# Altium schematic sheet C-11 SOM HDR.SchDoc
size 513 x 386 mm; Address1: 350W 9th Ave; Address2: Suite 206; Address3: Escondido CA 92025; Address4: United States; Revision: -; ENG_APP_DATE: --/--/--; DSN_APP_DATE: --/--/--; CHK_APP_DATE: --/--/--
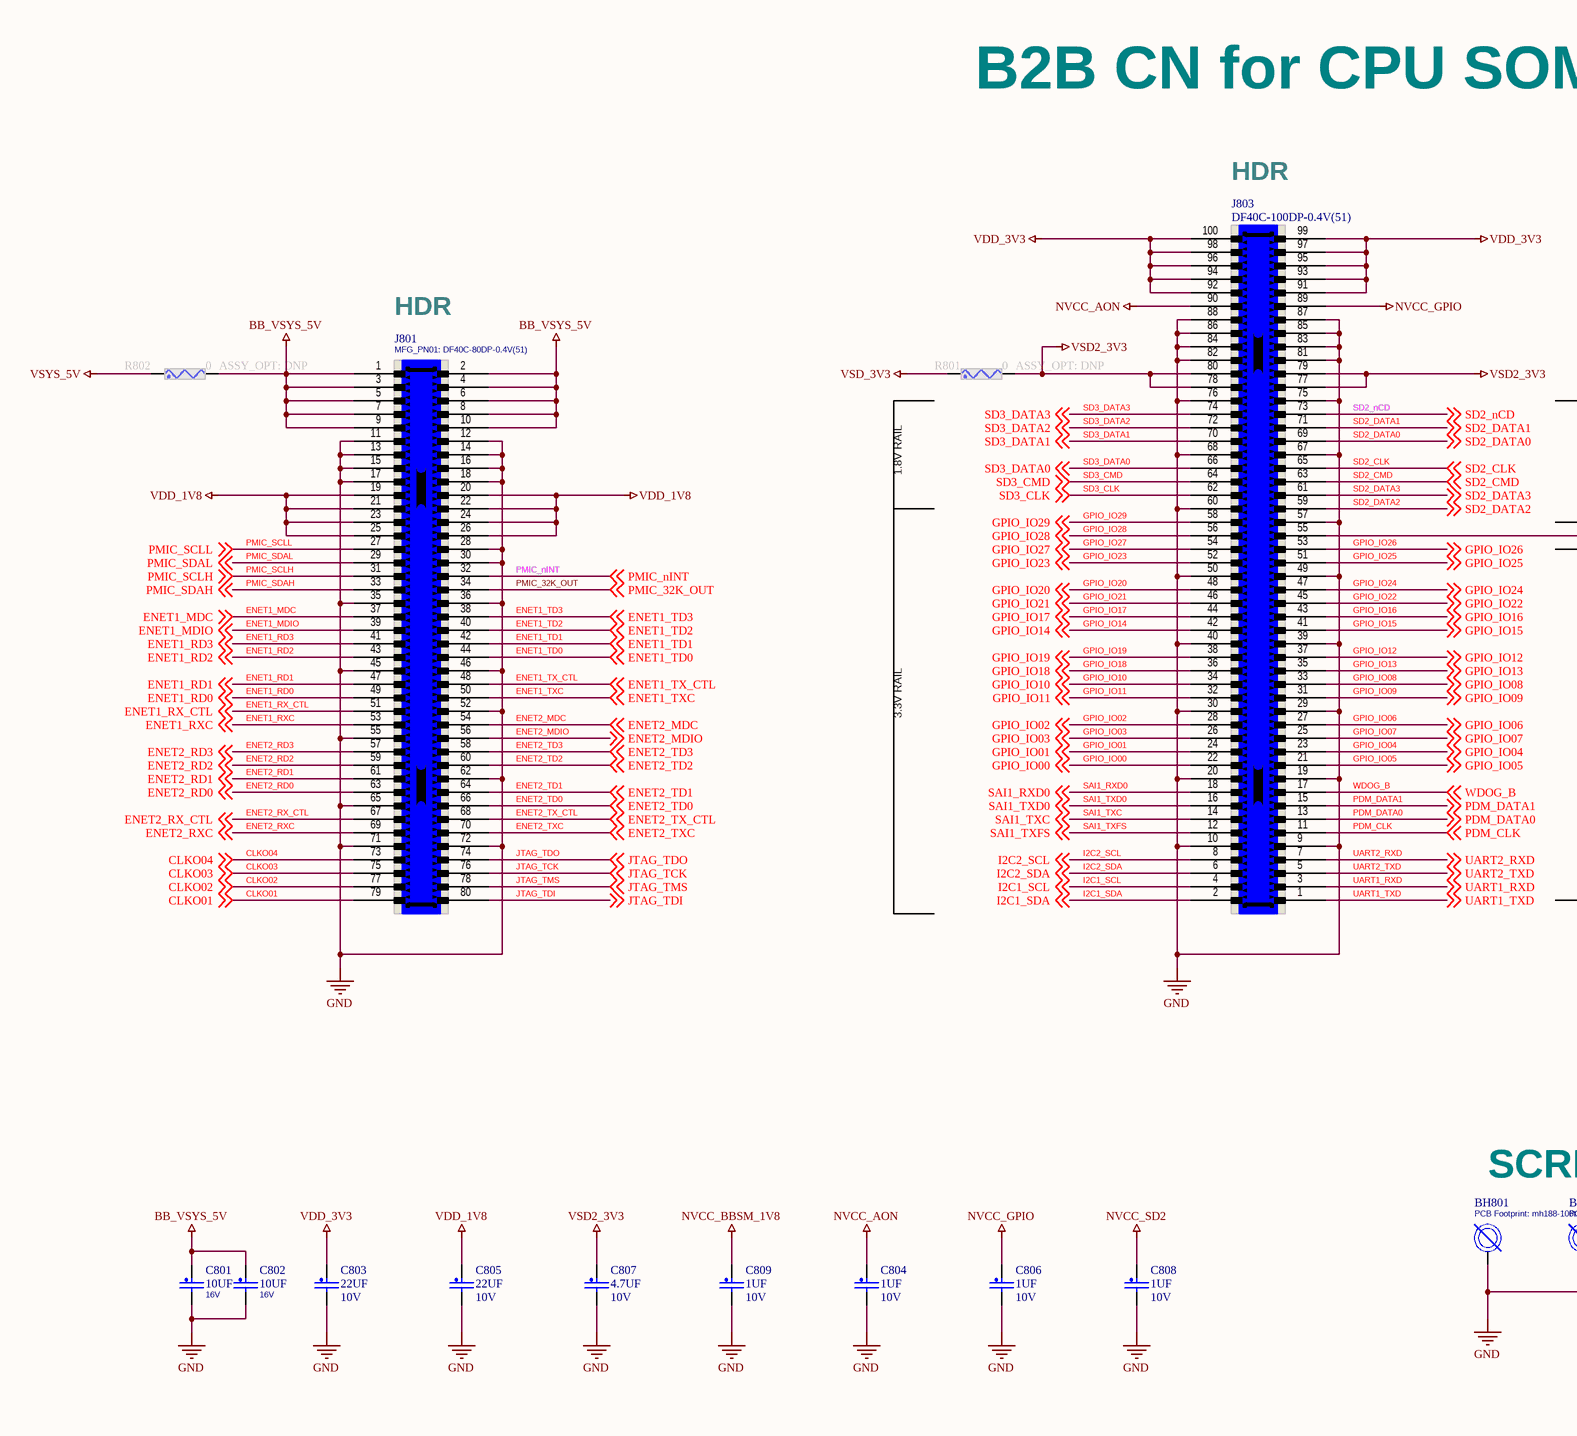
[diagram p0: C-11 SOM HDR.SchDoc, left]
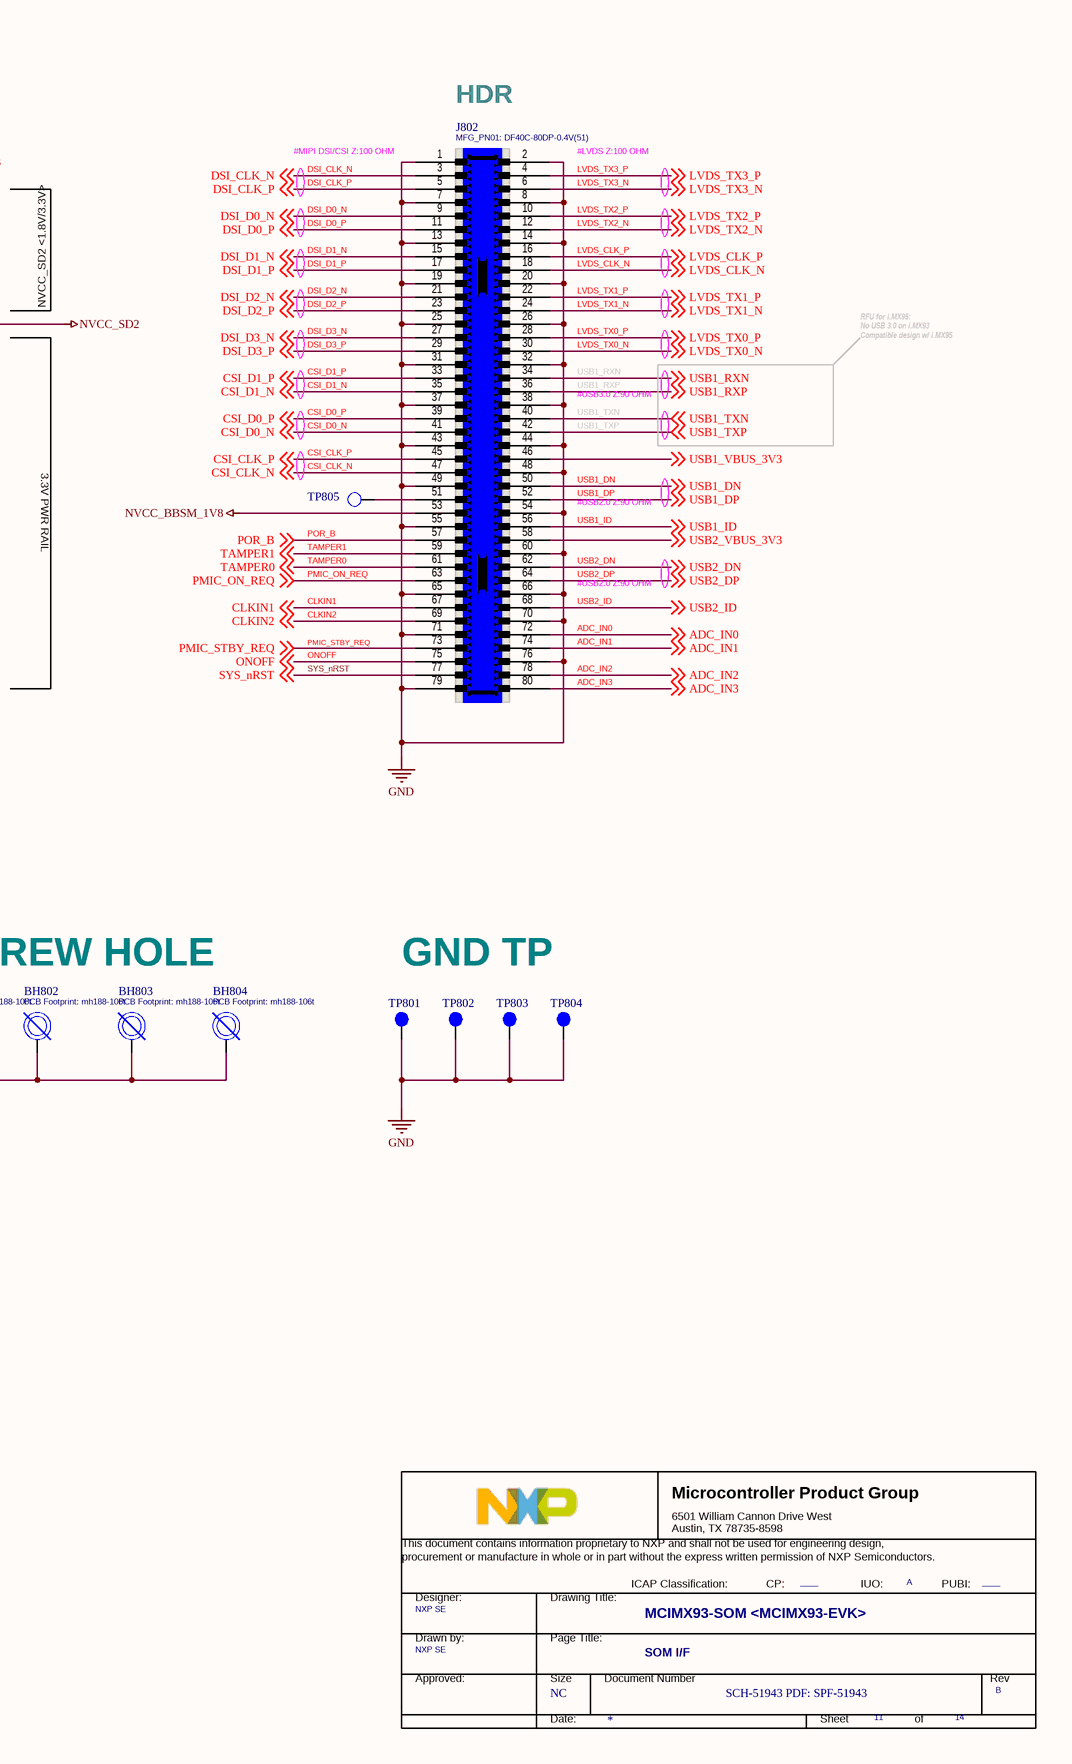
[diagram p1: C-11 SOM HDR.SchDoc, right]

## Parts
*  Doc: SCH-51943 PDF: SPF-51943  RevCode: B  Title: MCIMX93-SOM <MCIMX93-EVK>  Page Size: NC  Page Number: 11  Page Count: 14  PageTitle: SOM I/F  Designer: NXP SE  PUBI: ____  FIUO: A  (hidden comment: TitleBlock_MCPG)  (graphical)
BH801  FMC MOUNTING HOLE  [mh188-106t]  (value not drawn)
BH802  FMC MOUNTING HOLE  [mh188-106t]  (value not drawn)
BH803  FMC MOUNTING HOLE  [mh188-106t]  (value not drawn)
BH804  FMC MOUNTING HOLE  [mh188-106t]  (value not drawn)
C801  10UF  VOLTAGE: 16V  [CC0603]
C802  10UF  VOLTAGE: 16V  [CC0603]
C803  22UF  VOLTAGE: 10V  [CC0603]
C804  1UF  VOLTAGE: 10V  [0201_CC]
C805  22UF  VOLTAGE: 10V  [CC0603]
C806  1UF  VOLTAGE: 10V  [0201_CC]
C807  4.7UF  VOLTAGE: 10V  [cc0402_tol0p15]
C808  1UF  VOLTAGE: 10V  [0201_CC]
C809  1UF  VOLTAGE: 10V  [0201_CC]
J801  MFG_PN01: DF40C-80DP-0.4V(51)  [con80_0p4_17p7x2p05_sm]  (hidden comment: CON 2X40)
J802  MFG_PN01: DF40C-80DP-0.4V(51)  [con80_0p4_17p7x2p05_sm]  (hidden comment: CON 2X40)
J803  DF40C-100DP-0.4V(51)  [con100_0p4_21p7x2p05_sm]
R801  0  ASSY_OPT: DNP  [0603_CC]
R802  0  ASSY_OPT: DNP  [RC0805_OV]
TP801  TPAD_050  [TPAD_050]  (value not drawn)  (no BOM)
TP802  TPAD_050  [TPAD_050]  (value not drawn)  (no BOM)
TP803  TPAD_050  [TPAD_050]  (value not drawn)  (no BOM)
TP804  TPAD_050  [TPAD_050]  (value not drawn)  (no BOM)
TP805  TP_35MIL  [testpoint_35mil]  (value not drawn)  (no BOM)

## Nets
BB_VSYS_5V: C801.1 C802.1 J801.1(A1) J801.2(B1) J801.3(A2) J801.4(B2) J801.5(A3) J801.6(B3) J801.7(A4) J801.8(B4) J801.9(A5) J801.10(B5) R802.2
GND: BH801.1 BH802.1 BH803.1 BH804.1 C801.2 C802.2 C803.2 C804.2 C805.2 C806.2 C807.2 C808.2 C809.2 J801.11(A6) J801.12(B6) J801.13(A7) J801.14(B7) J801.15(A8) J801.16(B8) J801.17(A9) J801.18(B9) J801.28(B14) J801.30(B15) J801.35(A18) J801.36(B18) J801.45(A23) J801.46(B23) J801.52(B26) J801.55(A28) J801.62(B31) J801.65(A33) J801.71(A36) J801.72(B36) J802.1(A1) J802.2(B1) J802.7(A4) J802.8(B4) J802.13(A7) J802.14(B7) J802.19(A10) J802.20(B10) J802.25(A13) J802.26(B13) J802.31(A16) J802.32(B16) J802.37(A19) J802.38(B19) J802.43(A22) J802.44(B22) J802.48(B24) J802.49(A25) J802.54(B27) J802.55(A28) J802.60(B30) J802.65(A33) J802.66(B33) J802.70(B35) J802.71(A36) J802.76(B38) J802.79(A40) J803.9 J803.10 J803.19 J803.20 J803.29 J803.30 J803.39 J803.40 J803.49 J803.50 J803.57 J803.60 J803.67 J803.68 J803.75 J803.76 J803.81 J803.82 J803.83 J803.84 J803.85 J803.86 J803.87 J803.88 TP801.1(Pin1) TP802.1(Pin1) TP803.1(Pin1) TP804.1(Pin1)
NVCC_AON: C804.1 J803.90
NVCC_BBSM_1V8: C809.1 J802.53(A27)
NVCC_GPIO: C806.1 J803.89
NVCC_SD2: C808.1 J803.55
VDD_1V8: C805.1 J801.19(A10) J801.20(B10) J801.21(A11) J801.22(B11) J801.23(A12) J801.24(B12) J801.25(A13) J801.26(B13)
VDD_3V3: C803.1 J803.91 J803.92 J803.93 J803.94 J803.95 J803.96 J803.97 J803.98 J803.99 J803.100
VSD2_3V3: C807.1 J803.77 J803.78 J803.79 J803.80 R801.2
VSD_3V3: R801.1
VSYS_5V: R802.1
ADC_IN0: J802.72(B36) ; off-sheet ADC_IN0
ADC_IN1: J802.74(B37) ; off-sheet ADC_IN1
ADC_IN2: J802.78(B39) ; off-sheet ADC_IN2
ADC_IN3: J802.80(B40) ; off-sheet ADC_IN3
CLKIN1: J802.67(A34) ; off-sheet CLKIN1
CLKIN2: J802.69(A35) ; off-sheet CLKIN2
CLKO01: J801.79(A40) ; off-sheet CLKO01
CLKO02: J801.77(A39) ; off-sheet CLKO02
CLKO03: J801.75(A38) ; off-sheet CLKO03
CLKO04: J801.73(A37) ; off-sheet CLKO04
CSI_CLK_N: J802.47(A24) ; off-sheet CSI_CLK_N
CSI_CLK_P: J802.45(A23) ; off-sheet CSI_CLK_P
CSI_D0_N: J802.41(A21) ; off-sheet CSI_D0_N
CSI_D0_P: J802.39(A20) ; off-sheet CSI_D0_P
CSI_D1_N: J802.35(A18) ; off-sheet CSI_D1_N
CSI_D1_P: J802.33(A17) ; off-sheet CSI_D1_P
DSI_CLK_N: J802.3(A2) ; off-sheet DSI_CLK_N
DSI_CLK_P: J802.5(A3) ; off-sheet DSI_CLK_P
DSI_D0_N: J802.9(A5) ; off-sheet DSI_D0_N
DSI_D0_P: J802.11(A6) ; off-sheet DSI_D0_P
DSI_D1_N: J802.15(A8) ; off-sheet DSI_D1_N
DSI_D1_P: J802.17(A9) ; off-sheet DSI_D1_P
DSI_D2_N: J802.21(A11) ; off-sheet DSI_D2_N
DSI_D2_P: J802.23(A12) ; off-sheet DSI_D2_P
DSI_D3_N: J802.27(A14) ; off-sheet DSI_D3_N
DSI_D3_P: J802.29(A15) ; off-sheet DSI_D3_P
ENET1_MDC: J801.37(A19) ; off-sheet ENET1_MDC
ENET1_MDIO: J801.39(A20) ; off-sheet ENET1_MDIO
ENET1_RD0: J801.49(A25) ; off-sheet ENET1_RD0
ENET1_RD1: J801.47(A24) ; off-sheet ENET1_RD1
ENET1_RD2: J801.43(A22) ; off-sheet ENET1_RD2
ENET1_RD3: J801.41(A21) ; off-sheet ENET1_RD3
ENET1_RX_CTL: J801.51(A26) ; off-sheet ENET1_RX_CTL
ENET1_RXC: J801.53(A27) ; off-sheet ENET1_RXC
ENET1_TD0: J801.44(B22) ; off-sheet ENET1_TD0
ENET1_TD1: J801.42(B21) ; off-sheet ENET1_TD1
ENET1_TD2: J801.40(B20) ; off-sheet ENET1_TD2
ENET1_TD3: J801.38(B19) ; off-sheet ENET1_TD3
ENET1_TX_CTL: J801.48(B24) ; off-sheet ENET1_TX_CTL
ENET1_TXC: J801.50(B25) ; off-sheet ENET1_TXC
ENET2_MDC: J801.54(B27) ; off-sheet ENET2_MDC
ENET2_MDIO: J801.56(B28) ; off-sheet ENET2_MDIO
ENET2_RD0: J801.63(A32) ; off-sheet ENET2_RD0
ENET2_RD1: J801.61(A31) ; off-sheet ENET2_RD1
ENET2_RD2: J801.59(A30) ; off-sheet ENET2_RD2
ENET2_RD3: J801.57(A29) ; off-sheet ENET2_RD3
ENET2_RX_CTL: J801.67(A34) ; off-sheet ENET2_RX_CTL
ENET2_RXC: J801.69(A35) ; off-sheet ENET2_RXC
ENET2_TD0: J801.66(B33) ; off-sheet ENET2_TD0
ENET2_TD1: J801.64(B32) ; off-sheet ENET2_TD1
ENET2_TD2: J801.60(B30) ; off-sheet ENET2_TD2
ENET2_TD3: J801.58(B29) ; off-sheet ENET2_TD3
ENET2_TX_CTL: J801.68(B34) ; off-sheet ENET2_TX_CTL
ENET2_TXC: J801.70(B35) ; off-sheet ENET2_TXC
GPIO_IO00: J803.22 ; off-sheet GPIO_IO00
GPIO_IO01: J803.24 ; off-sheet GPIO_IO01
GPIO_IO02: J803.28 ; off-sheet GPIO_IO02
GPIO_IO03: J803.26 ; off-sheet GPIO_IO03
GPIO_IO04: J803.23 ; off-sheet GPIO_IO04
GPIO_IO05: J803.21 ; off-sheet GPIO_IO05
GPIO_IO06: J803.27 ; off-sheet GPIO_IO06
GPIO_IO07: J803.25 ; off-sheet GPIO_IO07
GPIO_IO08: J803.33 ; off-sheet GPIO_IO08
GPIO_IO09: J803.31 ; off-sheet GPIO_IO09
GPIO_IO10: J803.34 ; off-sheet GPIO_IO10
GPIO_IO11: J803.32 ; off-sheet GPIO_IO11
GPIO_IO12: J803.37 ; off-sheet GPIO_IO12
GPIO_IO13: J803.35 ; off-sheet GPIO_IO13
GPIO_IO14: J803.42 ; off-sheet GPIO_IO14
GPIO_IO15: J803.41 ; off-sheet GPIO_IO15
GPIO_IO16: J803.43 ; off-sheet GPIO_IO16
GPIO_IO17: J803.44 ; off-sheet GPIO_IO17
GPIO_IO18: J803.36 ; off-sheet GPIO_IO18
GPIO_IO19: J803.38 ; off-sheet GPIO_IO19
GPIO_IO20: J803.48 ; off-sheet GPIO_IO20
GPIO_IO21: J803.46 ; off-sheet GPIO_IO21
GPIO_IO22: J803.45 ; off-sheet GPIO_IO22
GPIO_IO23: J803.52 ; off-sheet GPIO_IO23
GPIO_IO24: J803.47 ; off-sheet GPIO_IO24
GPIO_IO25: J803.51 ; off-sheet GPIO_IO25
GPIO_IO26: J803.53 ; off-sheet GPIO_IO26
GPIO_IO27: J803.54 ; off-sheet GPIO_IO27
GPIO_IO28: J803.56 ; off-sheet GPIO_IO28
GPIO_IO29: J803.58 ; off-sheet GPIO_IO29
I2C1_SCL: J803.4 ; off-sheet I2C1_SCL
I2C1_SDA: J803.2 ; off-sheet I2C1_SDA
I2C2_SCL: J803.8 ; off-sheet I2C2_SCL
I2C2_SDA: J803.6 ; off-sheet I2C2_SDA
JTAG_TCK: J801.76(B38) ; off-sheet JTAG_TCK
JTAG_TDI: J801.80(B40) ; off-sheet JTAG_TDI
JTAG_TDO: J801.74(B37) ; off-sheet JTAG_TDO
JTAG_TMS: J801.78(B39) ; off-sheet JTAG_TMS
LVDS_CLK_N: J802.18(B9) ; off-sheet LVDS_CLK_N
LVDS_CLK_P: J802.16(B8) ; off-sheet LVDS_CLK_P
LVDS_TX0_N: J802.30(B15) ; off-sheet LVDS_TX0_N
LVDS_TX0_P: J802.28(B14) ; off-sheet LVDS_TX0_P
LVDS_TX1_N: J802.24(B12) ; off-sheet LVDS_TX1_N
LVDS_TX1_P: J802.22(B11) ; off-sheet LVDS_TX1_P
LVDS_TX2_N: J802.12(B6) ; off-sheet LVDS_TX2_N
LVDS_TX2_P: J802.10(B5) ; off-sheet LVDS_TX2_P
LVDS_TX3_N: J802.6(B3) ; off-sheet LVDS_TX3_N
LVDS_TX3_P: J802.4(B2) ; off-sheet LVDS_TX3_P
ONOFF: J802.75(A38) ; off-sheet ONOFF
PDM_CLK: J803.11 ; off-sheet PDM_CLK
PDM_DATA0: J803.13 ; off-sheet PDM_DATA0
PDM_DATA1: J803.15 ; off-sheet PDM_DATA1
PMIC_32K_OUT: J801.34(B17) ; off-sheet PMIC_32K_OUT
PMIC_nINT: J801.32(B16) ; off-sheet PMIC_nINT
PMIC_ON_REQ: J802.63(A32) ; off-sheet PMIC_ON_REQ
PMIC_SCLH: J801.31(A16) ; off-sheet PMIC_SCLH
PMIC_SCLL: J801.27(A14) ; off-sheet PMIC_SCLL
PMIC_SDAH: J801.33(A17) ; off-sheet PMIC_SDAH
PMIC_SDAL: J801.29(A15) ; off-sheet PMIC_SDAL
PMIC_STBY_REQ: J802.73(A37) ; off-sheet PMIC_STBY_REQ
POR_B: J802.57(A29) ; off-sheet POR_B
SAI1_RXD0: J803.18 ; off-sheet SAI1_RXD0
SAI1_TXC: J803.14 ; off-sheet SAI1_TXC
SAI1_TXD0: J803.16 ; off-sheet SAI1_TXD0
SAI1_TXFS: J803.12 ; off-sheet SAI1_TXFS
SD2_CLK: J803.65 ; off-sheet SD2_CLK
SD2_CMD: J803.63 ; off-sheet SD2_CMD
SD2_DATA0: J803.69 ; off-sheet SD2_DATA0
SD2_DATA1: J803.71 ; off-sheet SD2_DATA1
SD2_DATA2: J803.59 ; off-sheet SD2_DATA2
SD2_DATA3: J803.61 ; off-sheet SD2_DATA3
SD2_nCD: J803.73 ; off-sheet SD2_nCD
SD3_CLK: J803.62 ; off-sheet SD3_CLK
SD3_CMD: J803.64 ; off-sheet SD3_CMD
SD3_DATA0: J803.66 ; off-sheet SD3_DATA0
SD3_DATA1: J803.70 ; off-sheet SD3_DATA1
SD3_DATA2: J803.72 ; off-sheet SD3_DATA2
SD3_DATA3: J803.74 ; off-sheet SD3_DATA3
SYS_nRST: J802.77(A39) ; off-sheet SYS_nRST
TAMPER0: J802.61(A31) ; off-sheet TAMPER0
TAMPER1: J802.59(A30) ; off-sheet TAMPER1
UART1_RXD: J803.3 ; off-sheet UART1_RXD
UART1_TXD: J803.1 ; off-sheet UART1_TXD
UART2_RXD: J803.7 ; off-sheet UART2_RXD
UART2_TXD: J803.5 ; off-sheet UART2_TXD
USB1_DN: J802.50(B25) ; off-sheet USB1_DN
USB1_DP: J802.52(B26) ; off-sheet USB1_DP
USB1_ID: J802.56(B28) ; off-sheet USB1_ID
USB1_RXN: J802.34(B17) ; off-sheet USB1_RXN
USB1_RXP: J802.36(B18) ; off-sheet USB1_RXP
USB1_TXN: J802.40(B20) ; off-sheet USB1_TXN
USB1_TXP: J802.42(B21) ; off-sheet USB1_TXP
USB1_VBUS_3V3: J802.46(B23) ; off-sheet USB1_VBUS_3V3
USB2_DN: J802.62(B31) ; off-sheet USB2_DN
USB2_DP: J802.64(B32) ; off-sheet USB2_DP
USB2_ID: J802.68(B34) ; off-sheet USB2_ID
USB2_VBUS_3V3: J802.58(B29) ; off-sheet USB2_VBUS_3V3
WDOG_B: J803.17 ; off-sheet WDOG_B
NetJ802_51: J802.51(A26) TP805.1(TP)

## Notes on the sheet
- B2B CN for CPU SOM
- (near J803) HDR
- (near J801) HDR
- (near J802) HDR
- #MIPI DSI/CSI Z:100 OHM
- #LVDS Z:100 OHM
- 1.8V RAIL
- NVCC_SD2 <1.8V/3.3V>
- RFU for i.MX95:
  No USB 3.0 on i.MX93
  Compatible design w/ i.MX95
- #USB3.0 Z:90 OHM
- 3.3V PWR RAIL
- 3.3V RAIL
- #USB2.0 Z:90 OHM
- SCREW HOLE
- GND TP
- 8
- 7
- 6
- 5
- 4
- 3
- 2
- 1
- REVISION
- DESCRIPTION
- DATE
- APPROVED
- F
- E
- D
- C
- B
- PROJECT:
- REV.
- ENG:
- APPROVALS
- PROJECT
- JordanDSP LLC <https://www.jordandsp.com>
- Envision Excellence
- SHT.
- A
- DSN:
- CHK:
- REFERENCE ITEMS
- PRJ VCS REVISION:
- TITLE
- DOC VCS REVISION:
- MODIFIED DATE:
- BOM:
- FAB DWG:
- FIRMWARE:
- ASSY DWG:
- SCALE:
- SIZE
- CAGE CODE
- FILE NAME
- DWG NO.
- PAGE
- PRODUCT REV
- OF
- (in symbol TitleBlock_MCPG) Microcontroller Product Group; 6501 William Cannon Drive West / Austin, TX 78735-8598; This document contains information proprietary to NXP and shall not be used for engineering design,; procurement or manufacture in whole or in part without the express written permission of NXP Semiconductors.; ICAP Classification:; CP:; IUO:; PUBI:; Designer:; Drawing Title:; Drawn by:; Page Title:; Approved:; Size; Document Number; Rev; Date:; Sheet; of

## Library data of the parts
* = TitleBlock_MCPG: OrgAddr1: NO. 192 Liangjing Rd. Pudong New Area, ShangHai; OrgName: NXP Semiconductor; Page Create Date: March  8, 1995; DrawnBy: NXP SE; FCP: ____; Page Modify Date: *
BH801-BH803 = MOUNT_HOLE: MOUNTING HOLE PLATED DRILL 2.7MM KEEPOUT R2.9MM TH, NO PART TO ORDER; CLASS: IC; MFG_PN01: NOTACOMPONENT; CAD_APPROVED: Yes; AGILE_PN: 280-76791; MFG_NAME01: NOTACOMPONENT; ROHS: Yes; HEIGHT: 0.1MM; PCB Footprint: mh188-106t
BH804 = MOUNT_HOLE: MOUNTING HOLE PLATED DRILL 2.7MM KEEPOUT R2.9MM TH, NO PART TO ORDER; CLASS: IC; AGILE_PN: 280-76791; CAD_APPROVED: Yes; MFG_NAME01: NOTACOMPONENT; HEIGHT: 0.1MM; ROHS: Yes; MFG_PN01: NOTACOMPONENT; PCB Footprint: mh188-106t
C801 = CAP_NP: CAP CER 10.0uF 16V 10% X5R 0603; CLASS: DISCRETE; AGILE_PN: 150-80060; MFG_NAME01: MURATA; MFG_PN01: GRM188R61C106KAALD; Temp_Range: -55¡ãC to +85¡ãC; CAD_APPROVED: Yes; FPLIST: CC0603_OV,CC0603,0603_CC,cc0603_0805_nsp; Tolerance: 10%; ROHS: Yes; HEIGHT: 0.9MM; Package Size: 0603; Package Type: SMT; Temp Range: -55¡ãC to +85¡ãC; PCB Footprint: CC0603
C802 = CAP_NP: CAP CER 10.0uF 16V 10% X5R 0603; CLASS: DISCRETE; FPLIST: CC0603_OV,CC0603,0603_CC,cc0603_0805_nsp; CAD_APPROVED: Yes; Temp_Range: -55¡ãC to +85¡ãC; MFG_PN01: GRM188R61C106KAALD; MFG_NAME01: MURATA; AGILE_PN: 150-80060; HEIGHT: 0.9MM; ROHS: Yes; Tolerance: 10%; Package Size: 0603; Package Type: SMT; Temp Range: -55¡ãC to +85¡ãC; PCB Footprint: CC0603
C803 C805 = CAP_NP: CAP CER 22uF 10V 20% X5R 0603; CLASS: DISCRETE; SIGNAL_MODEL: DEFAULT_CAPACITOR_2.2e+07pF_2_1; FPLIST: CC0603_OV,CC0603,0603_cc_tol; CAD_APPROVED: Yes; MFG_PN01: C1608X5R1A226M080AC; MFG_NAME01: TDK; AGILE_PN: 150-79530; WVDC: 6.3V; HEIGHT: 1MM; ROHS: Yes; Tolerance: 20%; Package Size: 0603; PCB Footprint: CC0603
C804 C806 C809 = CAP_NP: CAP CER 1.0uF 10V 10% X5R 0201; CLASS: DISCRETE; Temp Range: -55¡ãC to 85¡ãC; AGILE_PN: 150-81088; MFG_NAME01: SAMSUNG ELECTRO MECHANICS; MFG_PN01: CL03A105KP3NSNC; CAD_APPROVED: Yes; FPLIST: CC0201,CC0201_HD,0201_CC,cc_0201_cir; Tolerance: 10%; ROHS: Yes; HEIGHT: 0.35MM; Package Size: 0201 (0603 Metric); Package Type: SMD/SMT; PCB Footprint: 0201_CC
C807 = CAP_NP: CAP CER 4.7uF 10V 10% X5R 0402; CLASS: DISCRETE; FPLIST: cc0402_tol0p15,cc0402_tol0p15_ov,0402_cc_nsp; CAD_APPROVED: Yes; MFG_PN01: CL05A475KP5NRNC; MFG_NAME01: SAMSUNG ELECTRO MECHANICS; AGILE_PN: 150-80044; HEIGHT: 0.65MM; ROHS: Yes; Tolerance: 10%; PCB Footprint: cc0402_tol0p15; 3D_Mechanical_Footprint_File: cc0402_tol0p15
C808 = CAP_NP: CAP CER 1.0uF 10V 10% X5R 0201; CLASS: DISCRETE; FPLIST: CC0201,CC0201_HD,0201_CC,cc_0201_cir; CAD_APPROVED: Yes; MFG_PN01: CL03A105KP3NSNC; MFG_NAME01: SAMSUNG ELECTRO MECHANICS; AGILE_PN: 150-81088; Temp Range: -55¡ãC to 85¡ãC; Package Type: SMD/SMT; Package Size: 0201 (0603 Metric); HEIGHT: 0.35MM; ROHS: Yes; Tolerance: 10%; PCB Footprint: 0201_CC
J801 J802 = CON_2X40_A: CON 2X40 PLUG SHRD SMT 0.4MM SP 51H AU; CLASS: IO; 3D_Mechanical_Footprint_File: ftp://fcl.am.freescale.net/ALLEGRO/step/con80_0p4_17p7x2p05_sm.step; MFG_NAME01: HIROSE; CAD_APPROVED: Yes; AGILE_PN: 211-80176; PCB Footprint: con80_0p4_17p7x2p05_sm; ROHS: Yes; HEIGHT: 1.29MM
J803 = HDR_2X50_M_A: CON 2X50 PLUG SHRD SMT 0.4MM SP 51H AU; CLASS: IO; 3D_Mechanical_Footprint_File: ftp://fcl.am.freescale.net/ALLEGRO/step/con100_0p4_21p7x2p05_sm.step; MFG_NAME01: HIROSE; Temp Range: -35 to 85 &#8451;; CAD_APPROVED: Yes; AGILE_PN: 211-80305; PCB Footprint: con100_0p4_21p7x2p05_sm; MFG_PN01: DF40C-100DP-0.4V(51); ROHS: Yes; HEIGHT: 1.29MM
R801 = RES: RES MF ZERO OHM 1/10W -- 0603; CLASS: DISCRETE; Temp Range: ¨C55 ¡ãC to +155 ¡ãC; FPLIST: RC0603_OV,RC0603,R603-X2,0603_CC,IND_0603HP_NSP,CC0603_OV_NSP; CAD_APPROVED: Yes; MFG_PN01: WR06X000PTL; MFG_NAME01: WALSIN TECHNOLOGY CORP.; AGILE_PN: 470-80866; PCB Footprint: 0603_CC; HEIGHT: 0.6MM; ROHS: Yes
R802 = RES: RES MF ZERO OHM 1/8W -- 0805; CLASS: DISCRETE; AGILE_PN: 470-75442; FPLIST: RC0805_OV,RC0805,RC0805_OV_3P,0805_CC; Tolerance: 5%; CAD_APPROVED: Yes; Temp Range: ¨C55 ¡ãC to +155 ¡ãC; MFG_NAME01: YAGEO AMERICA; MFG_PN01: RC0805JR-070RL; PCB Footprint: RC0805_OV; HEIGHT: 0.7 MM; ROHS: Yes
TP801 TP802 = TESTLOOP: TEST POINT PAD 50MIL DIA SMT, NO PART TO ORDER; ASSY_OPT: DNP; CLASS: IO; AGILE_PN: 211-76644; MFG_NAME01: NOTACOMPONENT; CAD_APPROVED: Yes; MFG_PN01: NOTACOMPONENT; ROHS: Yes; HEIGHT: 0.1MM; PCB Footprint: TPAD_050
TP803 TP804 = TESTLOOP: TEST POINT PAD 50MIL DIA SMT, NO PART TO ORDER; ASSY_OPT: DNP; CLASS: IO; CAD_APPROVED: Yes; MFG_PN01: NOTACOMPONENT; AGILE_PN: 211-76644; HEIGHT: 0.1MM; ROHS: Yes; MFG_NAME01: NOTACOMPONENT; PCB Footprint: TPAD_050
TP805 = T POINT R: TEST POINT PAD .035 SMT, no part to order; ASSY_OPT: DNP; CLASS: IC; CAD_APPROVED: Yes; AGILE_PN: 510-75618; HEIGHT: 0.1MM; ROHS: Yes; PCB Footprint: testpoint_35mil